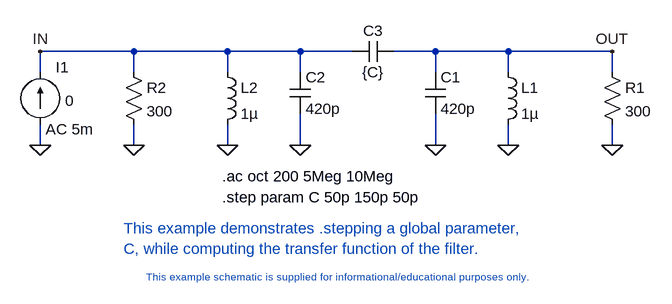
[diagram p0: schematic stepAC.asc]
stepAC.asc, the LTspice schematic file:
Version 4
SHEET 1 2412 1664
WIRE 1520 1248 1376 1248
WIRE 1664 1248 1520 1248
WIRE 1776 1248 1664 1248
WIRE 1856 1248 1776 1248
WIRE 1984 1248 1920 1248
WIRE 2096 1248 1984 1248
WIRE 2256 1248 2096 1248
WIRE 1376 1280 1376 1248
WIRE 1520 1280 1520 1248
WIRE 1664 1280 1664 1248
WIRE 1776 1280 1776 1248
WIRE 1984 1280 1984 1248
WIRE 2096 1280 2096 1248
WIRE 2256 1280 2256 1248
WIRE 1376 1392 1376 1360
WIRE 1520 1392 1520 1360
WIRE 1664 1392 1664 1360
WIRE 1776 1392 1776 1344
WIRE 1984 1392 1984 1344
WIRE 2096 1392 2096 1360
WIRE 2256 1392 2256 1360
FLAG 2096 1392 0
FLAG 1984 1392 0
FLAG 1664 1392 0
FLAG 1776 1392 0
FLAG 2256 1392 0
FLAG 1520 1392 0
FLAG 1376 1392 0
FLAG 1376 1248 IN
FLAG 2256 1248 OUT
SYMBOL ind 2080 1264 R0
SYMATTR InstName L1
SYMATTR Value 1µ
SYMBOL cap 1968 1280 R0
SYMATTR InstName C1
SYMATTR Value 420p
SYMBOL ind 1648 1264 R0
SYMATTR InstName L2
SYMATTR Value 1µ
SYMBOL cap 1760 1280 R0
SYMATTR InstName C2
SYMATTR Value 420p
SYMBOL cap 1920 1232 R90
WINDOW 0 0 32 VBottom 2
WINDOW 3 32 32 VTop 2
SYMATTR InstName C3
SYMATTR Value {C}
SYMBOL RES 2240 1264 R0
SYMATTR InstName R1
SYMATTR Value 300
SYMBOL CURRENT 1376 1360 M180
WINDOW 0 24 88 Left 2
WINDOW 3 38 36 Left 2
WINDOW 39 0 0 Left 2
WINDOW 123 8 -8 Left 2
SYMATTR InstName I1
SYMATTR Value 0
SYMATTR Value2 AC 5m
SYMBOL res 1504 1264 R0
SYMATTR InstName R2
SYMATTR Value 300
TEXT 1656 1440 Left 2 !.ac oct 200 5Meg 10Meg
TEXT 1656 1472 Left 2 !.step param C 50p 150p 50p
TEXT 1824 1584 Top 1 ;This example schematic is supplied for informational/educational purposes only.
TEXT 1504 1520 Left 2 ;This example demonstrates .stepping a global parameter,\nC, while computing the transfer function of the filter.

The netlist it stands for:
* stepAC.asc
L1 OUT 0 1µ
C1 OUT 0 420p
L2 IN 0 1µ
C2 IN 0 420p
C3 OUT IN {C}
R1 OUT 0 300
I1 0 IN 0 AC 5m
R2 IN 0 300
.ac oct 200 5Meg 10Meg
.step param C 50p 150p 50p
* This example schematic is supplied for informational/educational purposes only.
* This example demonstrates .stepping a global parameter,
* C, while computing the transfer function of the filter.
.backanno
.end